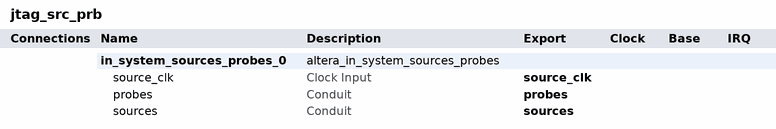
[diagram p0: system contents]
# Platform Designer (Qsys) system jtag_src_prb, Arria 10 10AS066H2F34I1SG
# Parameters at their usual value, and those the tool derives, are not listed.
package require -exact qsys 19.1
create_system jtag_src_prb
set_project_property DEVICE_FAMILY {Arria 10}
set_project_property DEVICE 10AS066H2F34I1SG

add_instance in_system_sources_probes_0 altera_in_system_sources_probes 19.1
set_instance_property in_system_sources_probes_0 AUTO_EXPORT true
set_instance_parameter_value in_system_sources_probes_0 create_source_clock true
set_instance_parameter_value in_system_sources_probes_0 instance_id CTRL
set_instance_parameter_value in_system_sources_probes_0 probe_width 128
set_instance_parameter_value in_system_sources_probes_0 source_width 128

# exported interfaces
add_interface probes conduit end
set_interface_property probes EXPORT_OF in_system_sources_probes_0.probes
add_interface source_clk clock sink
set_interface_property source_clk EXPORT_OF in_system_sources_probes_0.source_clk
add_interface sources conduit end
set_interface_property sources EXPORT_OF in_system_sources_probes_0.sources

save_system jtag_src_prb.qsys
